# EAGLE design Pump Control Circuit (EAGLE 7.5.0)
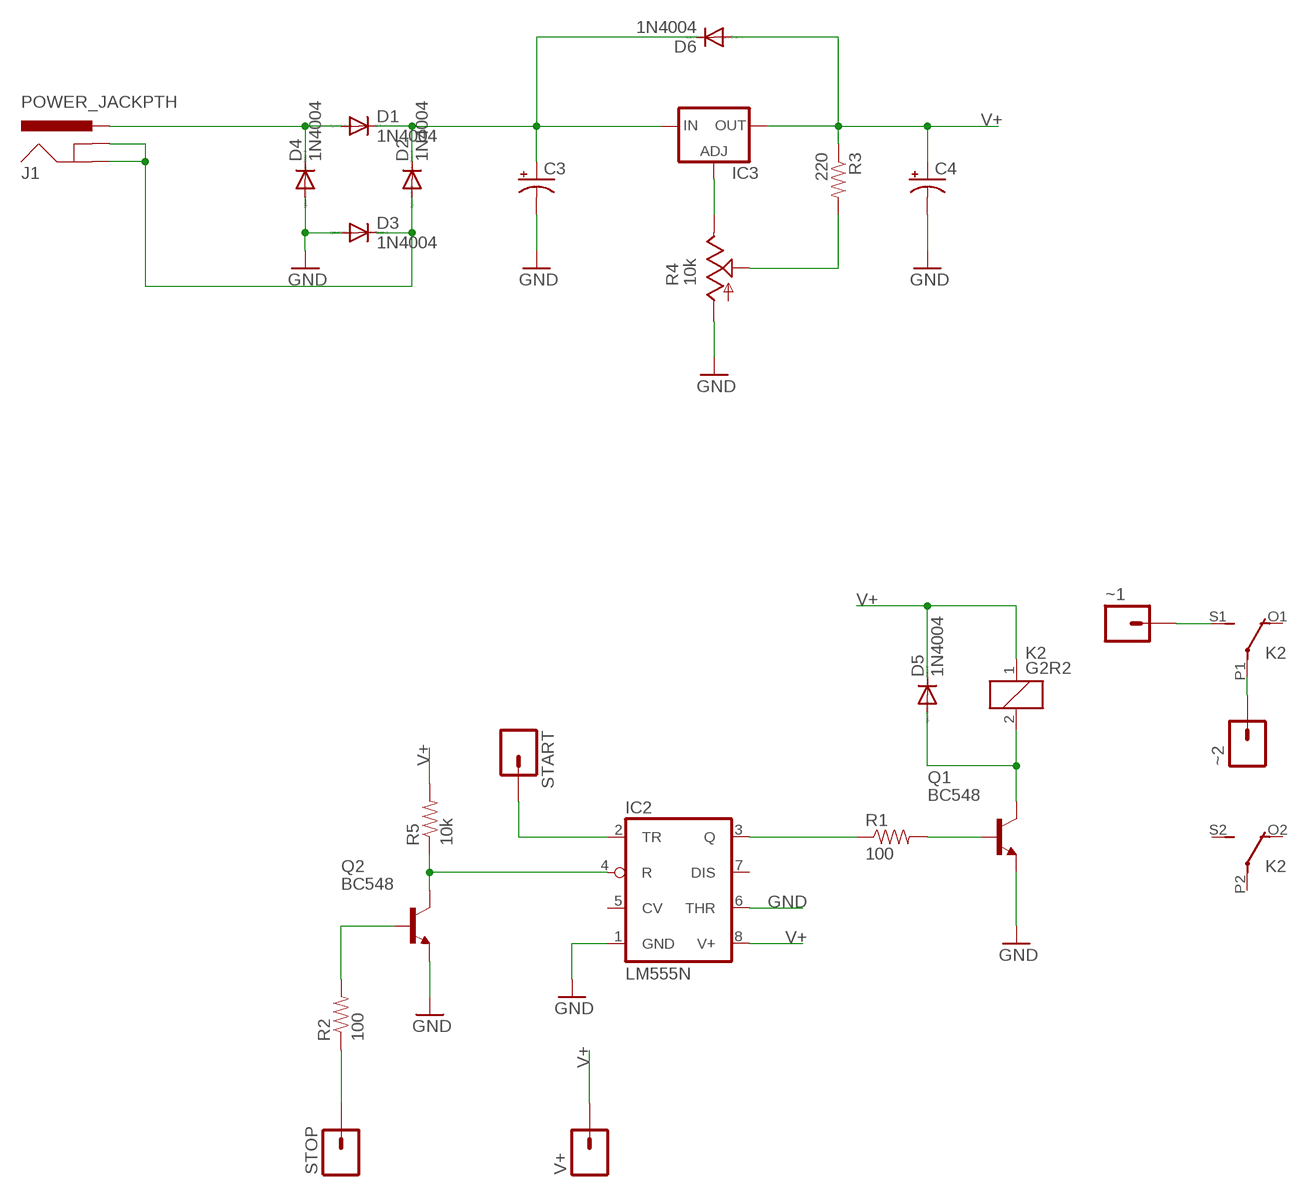
[diagram p0: schematic, sheet 1]

## Parts
C3  CAP_POLPTH1  [CPOL-RADIAL-100UF-25V]
C4  CAP_POLPTH4  [CPOL-RADIAL-1000UF-25V]
D1  1N4004  [DO41-10]
D2  1N4004  [DO41-10]
D3  1N4004  [DO41-10]
D4  1N4004  [DO41-10]
D5  1N4004  [DO41-10]
D6  1N4004  [DO41-10]
IC2  LM555N  [DIL08]
IC3  LM317TS  [317TS]
J1  POWER_JACKPTH  [POWER_JACK_PTH]
K2  G2R2  [G2R2]
Q1  BC548  [TO92-EBC]
Q2  BC548  [TO92-EBC]
R1  100  RESISTORAXIAL-0.3  [AXIAL-0.3]
R2  100  RESISTORAXIAL-0.3  [AXIAL-0.3]
R3  220  RESISTORAXIAL-0.3  [AXIAL-0.3]
R4  10k  TRIM_US-B64Y  [B64Y]
R5  10k  RESISTORAXIAL-0.3  [AXIAL-0.3]
START  M01PTH  [1X01]
STOP  M01PTH  [1X01]
V+  M01PTH  [1X01]
~1  M01PTH  [1X01]
~2  M01PTH  [1X01]

## Nets
GND: C3.2(-) C4.- D3.A D4.A IC2.1(GND) IC2.6(THR) Q1.E Q2.E R4.A
N$1: IC3.1(ADJ) R4.E
N$2: Q2.B R2.P$2
N$3: D1.A D4.C J1.PWR
N$4: IC2.4(R) Q2.C R5.P$1
N$5: IC2.2(TR) START.1
N$6: R3.P$2 R4.S
N$7: K2.S1(2:S) ~1.1
N$8: C3.1(+) D1.C D2.C D6.C IC3.3(IN)
N$9: K2.P1(2:P) ~2.1
N$12: Q1.B R1.P$2
N$13: D5.A K2.2 Q1.C
N$15: IC2.3(Q) R1.P$1
N$16: R2.P$1 STOP.1
NEUTRAL: D2.A D3.C J1.GND J1.GNDBREAK
V+: C4.+ D5.C D6.A IC2.8(V+) IC3.2(OUT) K2.1 R3.P$1 R5.P$2 V+.1
Unconnected: IC2.5(CV) IC2.7(DIS) K2.O1(2:O) K2.O2(3:O) K2.P2(3:P) K2.S2(3:S)

## Library data of the parts
C3 C4 = SparkFun-Capacitors:CAP_POL: Capacitor Polarized These are standard SMD and PTH capacitors. Normally 10uF, 47uF, and 100uF in electrolytic and tantalum varieties. Always verify the external diameter of the through hole cap, it varies with capacity, voltage, and manufacturer. The EIA devices should be standard.
D1-D6 = diode:1N4004: DIODE general purpose rectifier, 1 A
IC2 = linear:*555: TIMER
IC3 = v-reg:LM317TS: VOLTAGE REGULATOR
J1 = SparkFun-Connectors:POWER_JACK: Power Jack This is the standard 5.5mm barrel jack for power. The PTH is the most common, proven, reliable, footprint. The Slot footprint only works if the mill layer is transmitted to the PCB fab house so be warned. Mating wall wart : TOL-00298 (and others); PROD_ID: CONN-08197
K2 = relay:G2R2: RELAY 2 x switch, Omron; MF: OMRON COMPONENTS USA; MPN: G2R-2-DC6; OC_FARNELL: unknown; OC_NEWARK: 89C5317
Q1 Q2 = transistor-npn:BC548*: NPN Transistor
R1 R2 R5 = SparkFun-Resistors:RESISTOR: Resistor Basic schematic elements and footprints for 0603, 1206, and PTH resistors.
R3 = SparkFun-Passives:RESISTOR: Resistor Basic schematic elements and footprints for 0603, 1206, and PTH resistors.
R4 = pot:TRIM_US-: POTENTIOMETER
START STOP V+ ~1 ~2 = SparkFun-Connectors:M01: Header 1 Standard 1-pin 0.1" header. Use with straight break away headers (SKU : PRT-00116), right angle break away headers (PRT-00553), swiss pins (PRT-00743), machine pins (PRT-00117), and female headers (PRT-00115). SMTSO-256-ET is a "flush mount" nut for a 4-40 screw. The older package used to be too tight, and did not allow it to sit properly thru the drill hit. The latest (0.165DIA) fits nice and snug.

## Board
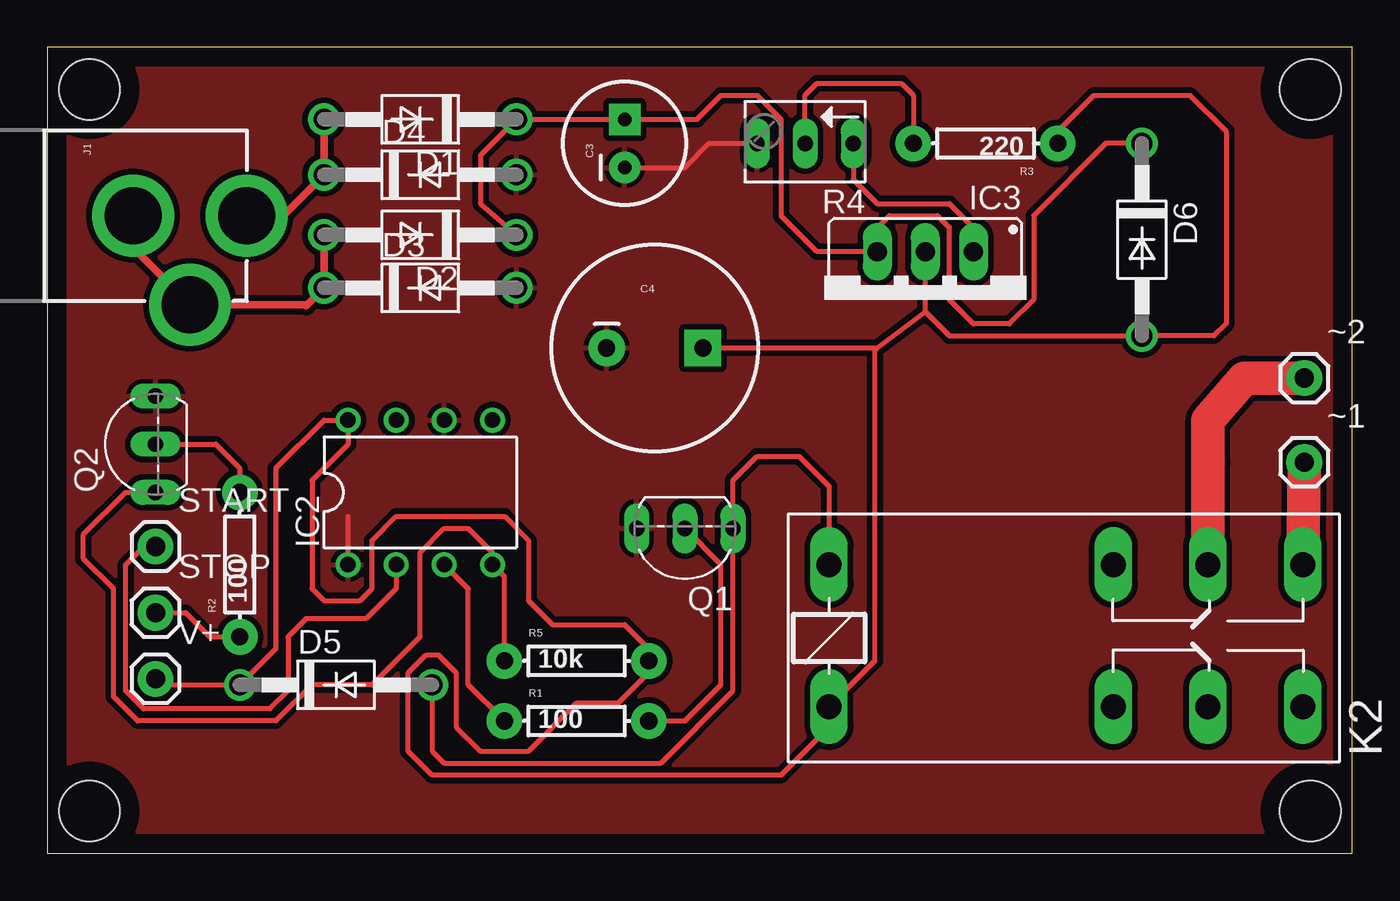
[diagram p1: board, top side]

Size 68.89 x 42.53 mm. Coordinates in mm from the lower left corner, seen from the top.
Outline: 0,0 68.89,0 68.89,42.53 0,42.53 0,0
Copper layers (1*16): Top 0.035mm / dielectric 1.5mm / Bottom 0.035mm
Design rules "default": minimum track width 10mil, minimum drill 24mil, track to track 8mil, track to pad 8mil, pad to pad 8mil, via to via 8mil, smd to smd 8mil, copper to edge 40mil, drill to drill 8mil, minimum pad ring 10mil, minimum via ring 8mil, stop-mask expansion 4mil, vias tented up to drill 0mil, thermal gap 10mil
Holes 3.2 mm at 2.22,40.32 2.22,2.22 66.67,40.32 66.67,2.22

### Footprints (pad centres in the part's own frame; a part is rotated, then mirrored left to right if it is on the bottom)
CPOL-RADIAL-100UF-25V = drill 0.7 pad 1.651 square: 1 1.27,0 | drill 0.7 pad 1.651: 2 -1.27,0
CPOL-RADIAL-1000UF-25V = drill 0.9 pad 1.93 square: + 2.54,0 | drill 0.9 pad 1.93: - -2.54,0
DO41-10 = drill 1.118: A 5.08,0; C -5.08,0
DIL08 = drill 0.813 pad 1.27: 1 -3.81,-3.81; 2 -1.27,-3.81; 3 1.27,-3.81; 4 3.81,-3.81; 5 3.81,3.81; 6 1.27,3.81; 7 -1.27,3.81; 8 -3.81,3.81
317TS = drill 1.016 long: 1 -2.54,-2.54; 2 0,-2.54; 3 2.54,-2.54
POWER_JACK_PTH = drill 2.997 pad 4.318: GND 0,7.7; GNDBREAK 4.7,10.7; PWR 0,13.7
G2R2 = drill 1.321 long: 1 -2.54,-3.683; 2 -2.54,3.81; O1 12.471,3.81; O2 12.471,-3.683; P1 17.45,3.81; P2 17.45,-3.683; S1 22.454,3.81; S2 22.454,-3.683
TO92-EBC = drill 0.813 long: B 0,-1.27; C -2.54,-1.27; E 2.54,-1.27
AXIAL-0.3 = drill 0.9 pad 1.88: P$1 -3.81,0; P$2 3.81,0
B64Y = drill 0.813 long: A 2.54,0; E -2.54,0; S 0,0
1X01 = drill 1.016 pad 1.88: 1 0,0

### Placement (x,y rotation side)
C3  30.48,37.47 90 top
C4  32.07,26.67 0 top
D1  19.68,38.73 180 top
D2  19.68,32.64 180 top
D3  19.68,29.84 0 top
D4  19.68,35.81 0 top
D5  15.24,8.89 0 top
D6  57.78,32.38 270 top
IC2  19.68,19.05 0 top
IC3  46.35,29.21 180 top
J1  -3.17,33.66 270 top
K2  43.81,11.43 0 top
Q1  33.66,15.88 180 top
Q2  4.45,21.59 90 top
R1  27.94,6.98 0 top
R2  10.16,15.24 90 top
R3  49.53,37.47 180 top
R4  40.01,37.47 180 top
R5  27.94,10.16 0 top
START  5.71,16.19 0 top
STOP  5.71,12.7 0 top
V+  5.71,9.21 0 top
~1  66.36,20.64 0 top
~2  66.36,25.08 0 top

### Tracks (layer width: path | path; a pad name or v marks a point on that pad's centre or on a via)
GND
  Top 0.254: C3.2 33.66,36.19 34.92,37.47 R4.A | IC2.1 15.88,17.78
  pour Top (isolate 0.305): 0,42.55 68.9,42.55 68.9,0 0,0
N$1
  Top 0.254: R4.E 42.55,35.56 43.81,34.29 47.62,34.29 48.9,33.02 IC3.1
N$2
  Top 0.254: Q2.B 8.89,21.59 10.16,20.32 R2.P$2
N$3
  Top 0.406: J1.PWR 12.45,33.66 D4.C D1.A
N$4
  Top 0.254: R5.P$1 24.13,14.6 IC2.4 23.5,15.88 22.23,17.14 20.95,17.14 19.68,15.88 19.68,11.43 17.14,8.89 13.97,8.89 12.06,6.98 4.76,6.98 3.49,8.25 3.49,13.97 1.91,15.56 1.91,16.83 4.13,19.05 Q2.C
N$5
  Top 0.254: IC2.2 18.41,13.97 16.83,12.38 13.65,12.38 12.7,11.43 12.7,8.57 11.75,7.62 5.08,7.62 4.13,8.57 4.13,15.24 5.08,16.19 START.1
N$6
  Top 0.254: R4.S 40.01,40 40.64,40.64 45.09,40.64 45.72,40 R3.P$2
N$7
  Top 1.778: ~1.1 K2.S1
N$8
  Top 0.254: D2.C 22.86,34.29 22.86,36.83 D1.C C3.1 34.29,38.73 35.56,40 37.47,40 38.73,38.73 38.73,33.66 40.64,31.75 IC3.3 43.81,33.02 44.45,33.66 46.99,33.66 47.62,33.02 47.62,29.21 48.9,27.94 50.8,27.94 52.07,29.21 52.07,33.66 55.88,37.47 D6.C
N$9
  Top 1.778: K2.P1 61.28,20.64 61.28,22.86 63.18,25.08 ~2.1
N$12
  Top 0.254: R1.P$2 33.66,6.98 35.56,8.89 35.56,15.24 Q1.B
N$13
  Top 0.254: D5.A 20.32,5.4 20.95,4.76 32.38,4.76 36.2,8.57 Q1.C 36.2,19.68 37.47,20.95 39.69,20.95 41.27,19.37 K2.2
N$15
  Top 0.254: R1.P$1 22.23,8.89 22.23,13.97 IC2.3
N$16
  Top 0.254: STOP.1 7.3,12.7 8.57,11.43 R2.P$1
NEUTRAL
  Top 0.406: J1.GND 4.53,31.95 J1.GNDBREAK 13.59,28.95 13.65,28.89 D3.C D2.A
V+
  Top 0.254: C4.+ 43.81,26.67 | 43.81,26.67 46.35,28.58 | 46.35,28.58 47.62,27.3 D6.A 61.59,27.3 62.23,27.94 62.23,38.1 60.33,40 55.24,40 53.34,38.1 R3.P$1 | V+.1 6.03,8.89 D5.C 12.06,10.79 12.06,20.32 14.61,22.86 IC2.8 15.88,21.59 13.97,19.68 13.97,13.97 14.61,13.33 16.51,13.33 17.14,13.97 17.14,16.51 18.41,17.78 24.13,17.78 25.4,16.51 25.4,13.33 26.67,12.06 30.48,12.06 31.75,10.79 R5.P$2 31.75,9.52 30.16,7.94 27.94,7.94 25.4,5.4 22.86,5.4 21.59,6.67 21.59,9.52 20.64,10.48 20,10.48 19.05,9.52 19.05,5.4 20.32,4.13 38.73,4.13 41.27,6.67 K2.1 43.69,10.16 43.69,26.54 43.81,26.67 | 46.35,28.58 IC3.2